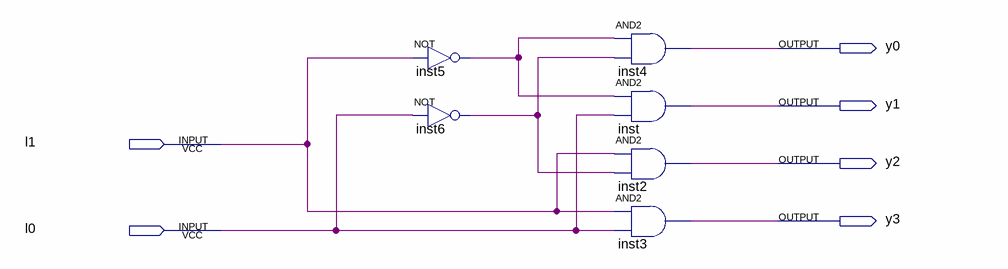
[diagram p0: schematic sheet]
// Quartus schematic 2_4decoder.bdf as structural Verilog: 6 symbols, 6 pins
module \2_4decoder  (
  input  l1,
  input  l0,
  output y0,
  output y1,
  output y2,
  output y3
);

  wire inst5_out, inst6_out;

  not inst5 (inst5_out, l1);
  not inst6 (inst6_out, l0);
  and inst4 (y0, inst5_out, inst6_out);
  and inst (y1, inst5_out, l0);
  and inst2 (y2, l1, inst6_out);
  and inst3 (y3, l1, l0);
endmodule
